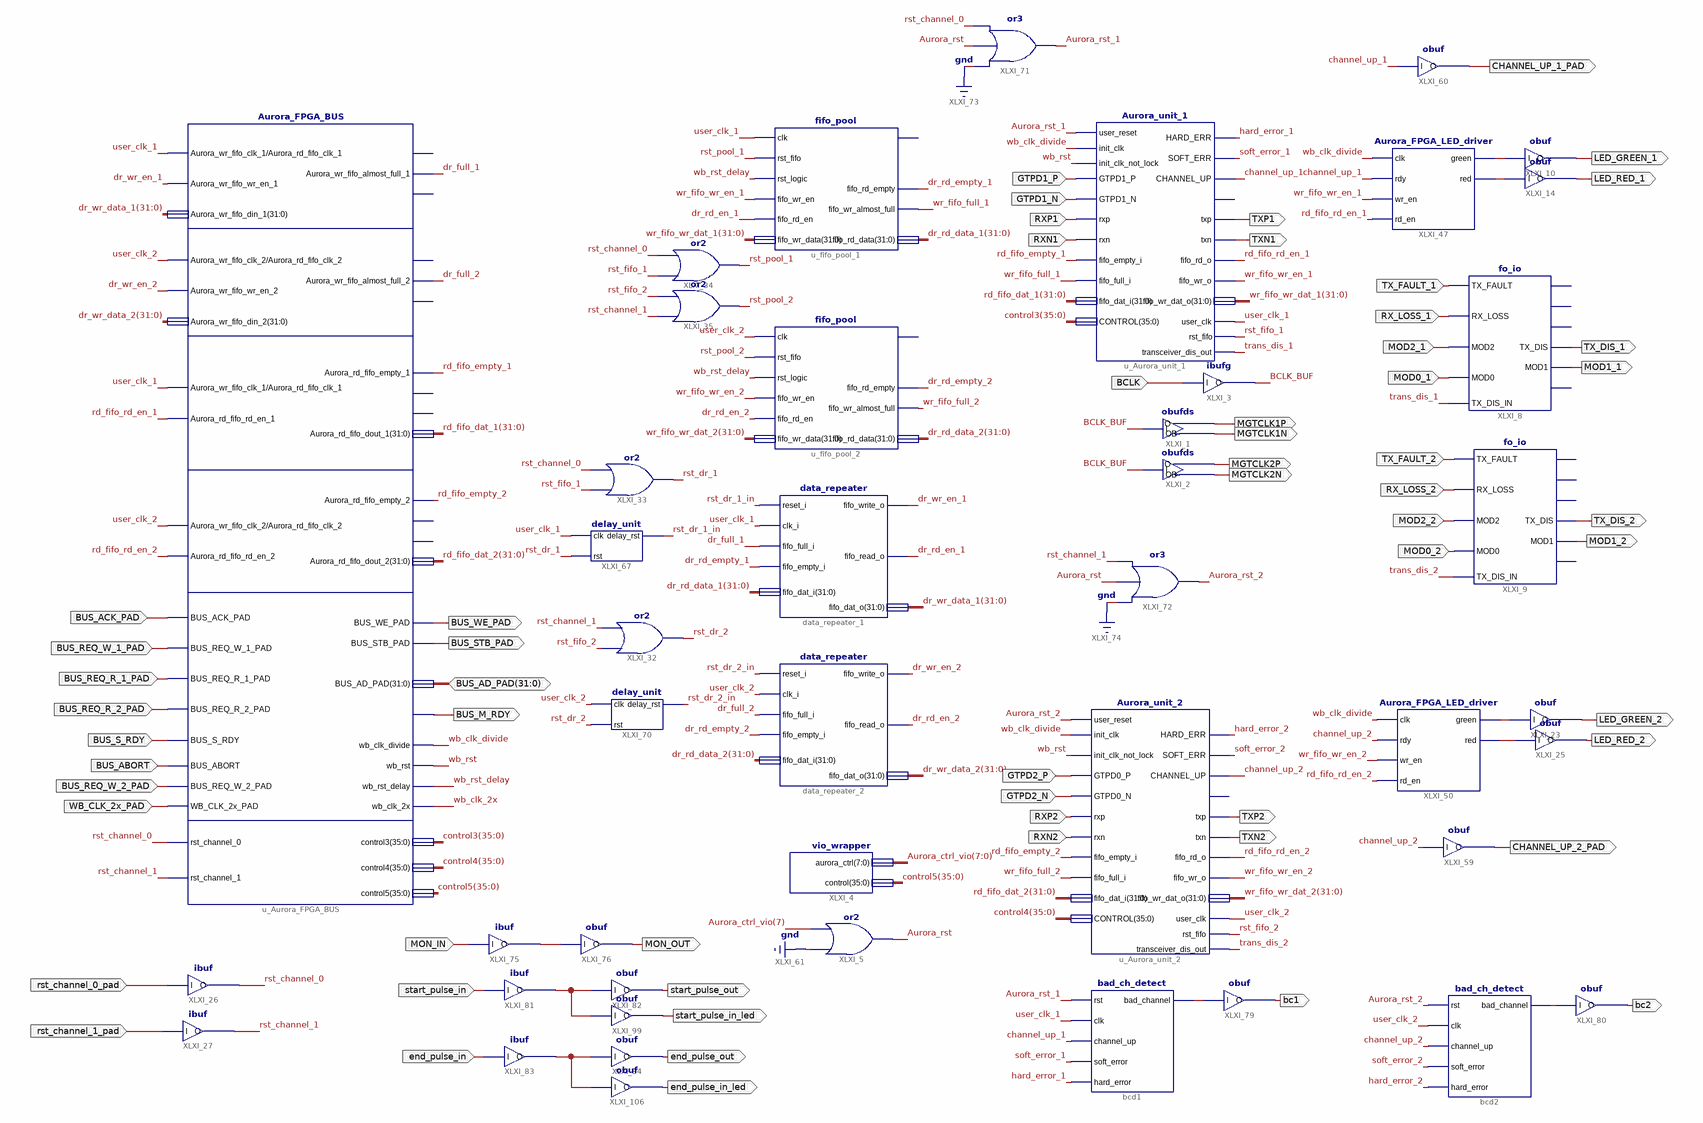
[diagram p0: schematic sheet 1]
// Xilinx ISE schematic Aurora_FPGA.sch (spartan6) as structural Verilog: 44 symbols, 59 ports
module Aurora_FPGA (
  input  BUS_ACK_PAD,
  input  BUS_REQ_W_1_PAD,
  input  BUS_REQ_R_1_PAD,
  input  BUS_REQ_R_2_PAD,
  input  WB_CLK_2x_PAD,
  input  BUS_S_RDY,
  input  BUS_ABORT,
  input  BUS_REQ_W_2_PAD,
  input  GTPD1_P,
  input  GTPD1_N,
  input  RXP1,
  input  RXN1,
  input  BCLK,
  input  rst_channel_0_pad,
  input  rst_channel_1_pad,
  input  TX_FAULT_1,
  input  RX_LOSS_1,
  input  MOD2_1,
  input  MOD0_1,
  input  TX_FAULT_2,
  input  RX_LOSS_2,
  input  MOD2_2,
  input  MOD0_2,
  input  GTPD2_P,
  input  GTPD2_N,
  input  RXP2,
  input  RXN2,
  input  MON_IN,
  input  start_pulse_in,
  input  end_pulse_in,
  inout  [31:0] BUS_AD_PAD,
  output BUS_WE_PAD,
  output BUS_STB_PAD,
  output BUS_M_RDY,
  output TXP1,
  output TXN1,
  output MGTCLK1P,
  output MGTCLK1N,
  output MGTCLK2P,
  output MGTCLK2N,
  output TX_DIS_1,
  output MOD1_1,
  output TX_DIS_2,
  output MOD1_2,
  output LED_GREEN_1,
  output LED_RED_1,
  output LED_GREEN_2,
  output LED_RED_2,
  output CHANNEL_UP_2_PAD,
  output CHANNEL_UP_1_PAD,
  output TXP2,
  output TXN2,
  output bc2,
  output bc1,
  output MON_OUT,
  output start_pulse_out,
  output start_pulse_in_led,
  output end_pulse_out,
  output end_pulse_in_led
);

  wire Aurora_rst, Aurora_rst_1, Aurora_rst_2, BCLK_BUF, channel_up_1, channel_up_2, dr_full_1, dr_full_2,
       dr_rd_empty_1, dr_rd_empty_2, dr_rd_en_1, dr_rd_en_2, dr_wr_en_1, dr_wr_en_2, hard_error_1,
       hard_error_2, rd_fifo_empty_1, rd_fifo_empty_2, rd_fifo_rd_en_1, rd_fifo_rd_en_2, rst_channel_0,
       rst_channel_1, rst_dr_1, rst_dr_1_in, rst_dr_2, rst_dr_2_in, rst_fifo_1, rst_fifo_2, rst_pool_1,
       rst_pool_2, soft_error_1, soft_error_2, trans_dis_1, trans_dis_2, user_clk_1, user_clk_2, wb_clk_2x,
       wb_clk_divide, wb_rst, wb_rst_delay, wr_fifo_full_1, wr_fifo_full_2, wr_fifo_wr_en_1, wr_fifo_wr_en_2,
       XLXN_41, XLXN_53, XLXN_93, XLXN_149, XLXN_159, XLXN_191, XLXN_193, XLXN_223, XLXN_233;
  wire [7:0] Aurora_ctrl_vio;
  wire [31:0] dr_rd_data_1, dr_rd_data_2, dr_wr_data_1, dr_wr_data_2, rd_fifo_dat_1, rd_fifo_dat_2,
       wr_fifo_wr_dat_1, wr_fifo_wr_dat_2;
  wire [35:0] control3, control4, control5;

  Aurora_FPGA_BUS u_Aurora_FPGA_BUS (
    .Aurora_wr_fifo_clk_1(user_clk_1), .Aurora_wr_fifo_wr_en_1(dr_wr_en_1),
    .Aurora_wr_fifo_din_1(dr_wr_data_1), .Aurora_wr_fifo_almost_full_1(dr_full_1),
    .Aurora_wr_fifo_almost_full_2(dr_full_2), .Aurora_wr_fifo_clk_2(user_clk_2),
    .Aurora_wr_fifo_wr_en_2(dr_wr_en_2), .Aurora_wr_fifo_din_2(dr_wr_data_2),
    .Aurora_rd_fifo_empty_1(rd_fifo_empty_1), .Aurora_rd_fifo_dout_1(rd_fifo_dat_1),
    .Aurora_rd_fifo_clk_1(user_clk_1), .Aurora_rd_fifo_rd_en_1(rd_fifo_rd_en_1),
    .Aurora_rd_fifo_empty_2(rd_fifo_empty_2), .Aurora_rd_fifo_dout_2(rd_fifo_dat_2),
    .Aurora_rd_fifo_clk_2(user_clk_2), .Aurora_rd_fifo_rd_en_2(rd_fifo_rd_en_2), .BUS_WE_PAD(BUS_WE_PAD),
    .BUS_STB_PAD(BUS_STB_PAD), .BUS_AD_PAD(BUS_AD_PAD), .BUS_ACK_PAD(BUS_ACK_PAD),
    .BUS_REQ_W_1_PAD(BUS_REQ_W_1_PAD), .BUS_REQ_R_1_PAD(BUS_REQ_R_1_PAD), .BUS_REQ_R_2_PAD(BUS_REQ_R_2_PAD),
    .WB_CLK_2x_PAD(WB_CLK_2x_PAD), .wb_clk_2x(wb_clk_2x), .wb_rst_delay(wb_rst_delay), .BUS_M_RDY(BUS_M_RDY),
    .BUS_S_RDY(BUS_S_RDY), .BUS_ABORT(BUS_ABORT), .BUS_REQ_W_2_PAD(BUS_REQ_W_2_PAD), .wb_rst(wb_rst),
    .wb_clk_divide(wb_clk_divide), .control3(control3), .control4(control4), .control5(control5),
    .rst_channel_0(rst_channel_0), .rst_channel_1(rst_channel_1));  // open: Aurora_wr_fifo_full_1, Aurora_wr_fifo_prog_full_1, Aurora_wr_fifo_full_2, Aurora_wr_fifo_prog_full_2, Aurora_rd_fifo_almost_empty_1, Aurora_rd_fifo_prog_empty_1, Aurora_rd_fifo_almost_empty_2, Aurora_rd_fifo_prog_empty_2
  Aurora_unit_1 u_Aurora_unit_1 (
    .GTPD1_P(GTPD1_P), .GTPD1_N(GTPD1_N), .rxp(RXP1), .rxn(RXN1), .fifo_empty_i(rd_fifo_empty_1),
    .fifo_full_i(wr_fifo_full_1), .fifo_dat_i(rd_fifo_dat_1), .HARD_ERR(hard_error_1),
    .SOFT_ERR(soft_error_1), .CHANNEL_UP(channel_up_1), .txp(TXP1), .txn(TXN1), .fifo_rd_o(rd_fifo_rd_en_1),
    .fifo_wr_o(wr_fifo_wr_en_1), .fifo_wr_dat_o(wr_fifo_wr_dat_1), .user_clk(user_clk_1), .CONTROL(control3),
    .user_reset(Aurora_rst_1), .init_clk_not_lock(wb_rst), .init_clk(wb_clk_divide), .rst_fifo(rst_fifo_1),
    .transceiver_dis_out(trans_dis_1));  // open: LANE_UP
  obufds XLXI_1 (.I(BCLK_BUF), .O(MGTCLK1P), .OB(MGTCLK1N));
  obufds XLXI_2 (.I(BCLK_BUF), .O(MGTCLK2P), .OB(MGTCLK2N));
  ibufg XLXI_3 (.I(BCLK), .O(BCLK_BUF));
  fifo_pool u_fifo_pool_2 (
    .clk(user_clk_2), .rst_fifo(rst_pool_2), .rst_logic(wb_rst_delay), .fifo_wr_en(wr_fifo_wr_en_2),
    .fifo_rd_en(dr_rd_en_2), .fifo_wr_data(wr_fifo_wr_dat_2), .fifo_rd_empty(dr_rd_empty_2),
    .fifo_rd_data(dr_rd_data_2), .fifo_wr_almost_full(wr_fifo_full_2));  // open: fifo_wr_full
  fifo_pool u_fifo_pool_1 (
    .clk(user_clk_1), .rst_fifo(rst_pool_1), .rst_logic(wb_rst_delay), .fifo_wr_en(wr_fifo_wr_en_1),
    .fifo_rd_en(dr_rd_en_1), .fifo_wr_data(wr_fifo_wr_dat_1), .fifo_rd_empty(dr_rd_empty_1),
    .fifo_rd_data(dr_rd_data_1), .fifo_wr_almost_full(wr_fifo_full_1));  // open: fifo_wr_full
  data_repeater data_repeater_1 (
    .reset_i(rst_dr_1_in), .clk_i(user_clk_1), .fifo_full_i(dr_full_1), .fifo_empty_i(dr_rd_empty_1),
    .fifo_write_o(dr_wr_en_1), .fifo_read_o(dr_rd_en_1), .fifo_dat_o(dr_wr_data_1), .fifo_dat_i(dr_rd_data_1));
  data_repeater data_repeater_2 (
    .reset_i(rst_dr_2_in), .clk_i(user_clk_2), .fifo_full_i(dr_full_2), .fifo_empty_i(dr_rd_empty_2),
    .fifo_write_o(dr_wr_en_2), .fifo_read_o(dr_rd_en_2), .fifo_dat_o(dr_wr_data_2), .fifo_dat_i(dr_rd_data_2));
  vio_wrapper XLXI_4 (.control(control5), .aurora_ctrl(Aurora_ctrl_vio));
  or XLXI_5 (Aurora_rst, 1'b0, Aurora_ctrl_vio[7]);
  ibuf XLXI_26 (.I(rst_channel_0_pad), .O(rst_channel_0));
  ibuf XLXI_27 (.I(rst_channel_1_pad), .O(rst_channel_1));
  or XLXI_34 (rst_pool_1, rst_fifo_1, rst_channel_0);
  or XLXI_35 (rst_pool_2, rst_channel_1, rst_fifo_2);
  fo_io XLXI_8 (
    .TX_FAULT(TX_FAULT_1), .RX_LOSS(RX_LOSS_1), .MOD2(MOD2_1), .MOD0(MOD0_1), .TX_DIS(TX_DIS_1),
    .MOD1(MOD1_1), .TX_DIS_IN(trans_dis_1));  // open: xTX_FAULT, xMOD2, xMOD0, xRX_LOSS_N
  fo_io XLXI_9 (
    .TX_FAULT(TX_FAULT_2), .RX_LOSS(RX_LOSS_2), .MOD2(MOD2_2), .MOD0(MOD0_2), .TX_DIS(TX_DIS_2),
    .MOD1(MOD1_2), .TX_DIS_IN(trans_dis_2));  // open: xTX_FAULT, xMOD2, xMOD0, xRX_LOSS_N
  Aurora_FPGA_LED_driver XLXI_47 (
    .clk(wb_clk_divide), .rdy(channel_up_1), .wr_en(wr_fifo_wr_en_1), .rd_en(rd_fifo_rd_en_1),
    .green(XLXN_93), .red(XLXN_41));
  obuf XLXI_10 (.I(XLXN_93), .O(LED_GREEN_1));
  obuf XLXI_14 (.I(XLXN_41), .O(LED_RED_1));
  Aurora_FPGA_LED_driver XLXI_50 (
    .clk(wb_clk_divide), .rdy(channel_up_2), .wr_en(wr_fifo_wr_en_2), .rd_en(rd_fifo_rd_en_2),
    .green(XLXN_149), .red(XLXN_53));
  obuf XLXI_23 (.I(XLXN_149), .O(LED_GREEN_2));
  obuf XLXI_25 (.I(XLXN_53), .O(LED_RED_2));
  obuf XLXI_59 (.I(channel_up_2), .O(CHANNEL_UP_2_PAD));
  obuf XLXI_60 (.I(channel_up_1), .O(CHANNEL_UP_1_PAD));
  Aurora_unit_2 u_Aurora_unit_2 (
    .GTPD0_P(GTPD2_P), .GTPD0_N(GTPD2_N), .rxp(RXP2), .rxn(RXN2), .fifo_empty_i(rd_fifo_empty_2),
    .fifo_full_i(wr_fifo_full_2), .fifo_dat_i(rd_fifo_dat_2), .HARD_ERR(hard_error_2),
    .SOFT_ERR(soft_error_2), .CHANNEL_UP(channel_up_2), .txp(TXP2), .txn(TXN2), .fifo_rd_o(rd_fifo_rd_en_2),
    .fifo_wr_o(wr_fifo_wr_en_2), .fifo_wr_dat_o(wr_fifo_wr_dat_2), .user_clk(user_clk_2), .CONTROL(control4),
    .user_reset(Aurora_rst_2), .init_clk_not_lock(wb_rst), .init_clk(wb_clk_divide), .rst_fifo(rst_fifo_2),
    .transceiver_dis_out(trans_dis_2));  // open: LANE_UP
  or XLXI_33 (rst_dr_1, rst_fifo_1, rst_channel_0);
  delay_unit XLXI_67 (.clk(user_clk_1), .rst(rst_dr_1), .delay_rst(rst_dr_1_in));
  or XLXI_32 (rst_dr_2, rst_fifo_2, rst_channel_1);
  delay_unit XLXI_70 (.clk(user_clk_2), .rst(rst_dr_2), .delay_rst(rst_dr_2_in));
  or XLXI_71 (Aurora_rst_1, 1'b0, Aurora_rst, rst_channel_0);
  or XLXI_72 (Aurora_rst_2, 1'b0, Aurora_rst, rst_channel_1);
  bad_ch_detect bcd1 (
    .rst(Aurora_rst_1), .clk(user_clk_1), .channel_up(channel_up_1), .soft_error(soft_error_1),
    .hard_error(hard_error_1), .bad_channel(XLXN_193));
  obuf XLXI_79 (.I(XLXN_193), .O(bc1));
  obuf XLXI_80 (.I(XLXN_191), .O(bc2));
  bad_ch_detect bcd2 (
    .rst(Aurora_rst_2), .clk(user_clk_2), .channel_up(channel_up_2), .soft_error(soft_error_2),
    .hard_error(hard_error_2), .bad_channel(XLXN_191));
  ibuf XLXI_75 (.I(MON_IN), .O(XLXN_159));
  obuf XLXI_76 (.I(XLXN_159), .O(MON_OUT));
  ibuf XLXI_81 (.I(start_pulse_in), .O(XLXN_223));
  obuf XLXI_82 (.I(XLXN_223), .O(start_pulse_out));
  obuf XLXI_99 (.I(XLXN_223), .O(start_pulse_in_led));
  ibuf XLXI_83 (.I(end_pulse_in), .O(XLXN_233));
  obuf XLXI_84 (.I(XLXN_233), .O(end_pulse_out));
  obuf XLXI_106 (.I(XLXN_233), .O(end_pulse_in_led));
endmodule
